# EAGLE design UART matrix v0.2 (EAGLE 7.4.0)
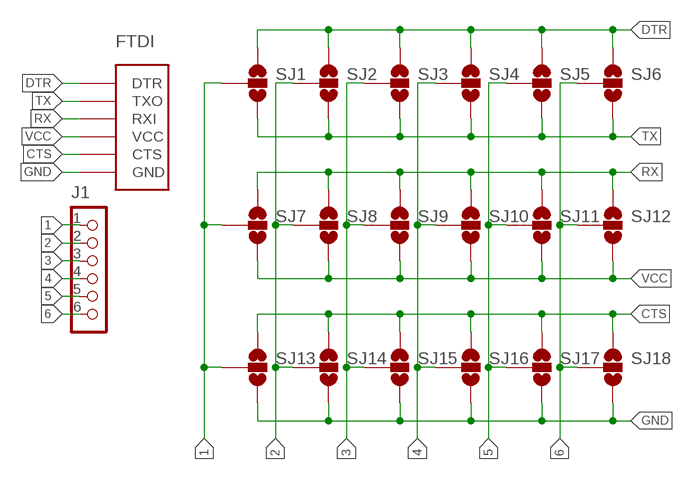
[diagram p0: schematic, sheet 1]

## Parts
FTDI  FTDI_DEVICE  [FTDI_DEVICE_SIDE]
J1  CON_HEADER_1X06-PTH  [M1X6]
SJ1  SOLDERJUMPER_2WAYT  [SJ_2]
SJ2  SOLDERJUMPER_2WAYT  [SJ_2]
SJ3  SOLDERJUMPER_2WAYT  [SJ_2]
SJ4  SOLDERJUMPER_2WAYT  [SJ_2]
SJ5  SOLDERJUMPER_2WAYT  [SJ_2]
SJ6  SOLDERJUMPER_2WAYT  [SJ_2]
SJ7  SOLDERJUMPER_2WAYT  [SJ_2]
SJ8  SOLDERJUMPER_2WAYT  [SJ_2]
SJ9  SOLDERJUMPER_2WAYT  [SJ_2]
SJ10  SOLDERJUMPER_2WAYT  [SJ_2]
SJ11  SOLDERJUMPER_2WAYT  [SJ_2]
SJ12  SOLDERJUMPER_2WAYT  [SJ_2]
SJ13  SOLDERJUMPER_2WAYT  [SJ_2]
SJ14  SOLDERJUMPER_2WAYT  [SJ_2]
SJ15  SOLDERJUMPER_2WAYT  [SJ_2]
SJ16  SOLDERJUMPER_2WAYT  [SJ_2]
SJ17  SOLDERJUMPER_2WAYT  [SJ_2]
SJ18  SOLDERJUMPER_2WAYT  [SJ_2]

## Nets
1: J1.1 SJ1.2 SJ7.2 SJ13.2
2: J1.2 SJ2.2 SJ8.2 SJ14.2
3: J1.3 SJ3.2 SJ9.2 SJ15.2
4: J1.4 SJ4.2 SJ10.2 SJ16.2
5: J1.5 SJ5.2 SJ11.2 SJ17.2
6: J1.6 SJ6.2 SJ12.2 SJ18.2
CTS: FTDI.P$5(CTS) SJ13.1 SJ14.1 SJ15.1 SJ16.1 SJ17.1 SJ18.1
DTR: FTDI.P$1(DTR) SJ1.1 SJ2.1 SJ3.1 SJ4.1 SJ5.1 SJ6.1
GND: FTDI.P$6(GND) SJ13.3 SJ14.3 SJ15.3 SJ16.3 SJ17.3 SJ18.3
RX: FTDI.P$3(RXI) SJ7.1 SJ8.1 SJ9.1 SJ10.1 SJ11.1 SJ12.1
TX: FTDI.P$2(TXO) SJ1.3 SJ2.3 SJ3.3 SJ4.3 SJ5.3 SJ6.3
VCC: FTDI.P$4(VCC) SJ7.3 SJ8.3 SJ9.3 SJ10.3 SJ11.3 SJ12.3

## Library data of the parts
FTDI = SparkFun-Connectors:FTDI_DEVICE: Connector which mates to FTDI basic or FTDI cable.
J1 = dp_devices:CON_HEADER_1X06
SJ1-SJ18 = SparkFun-Retired:SOLDERJUMPER_2WAY: Solder Jumper 2 way solder jumper

## Board
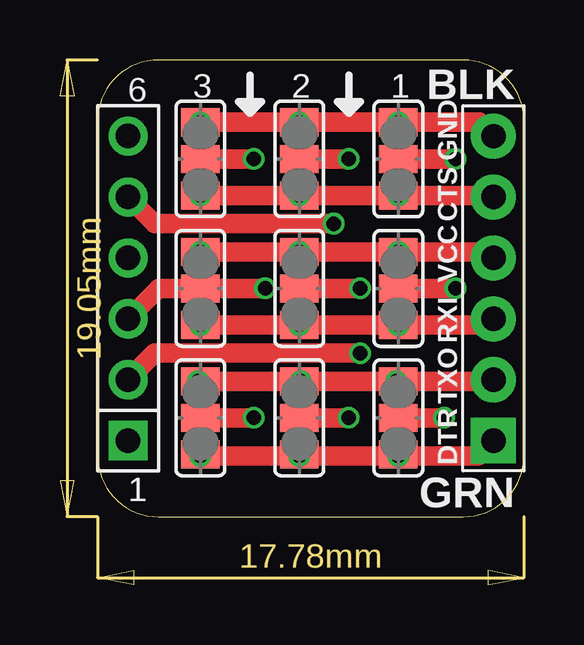
[diagram p1: board, top side]
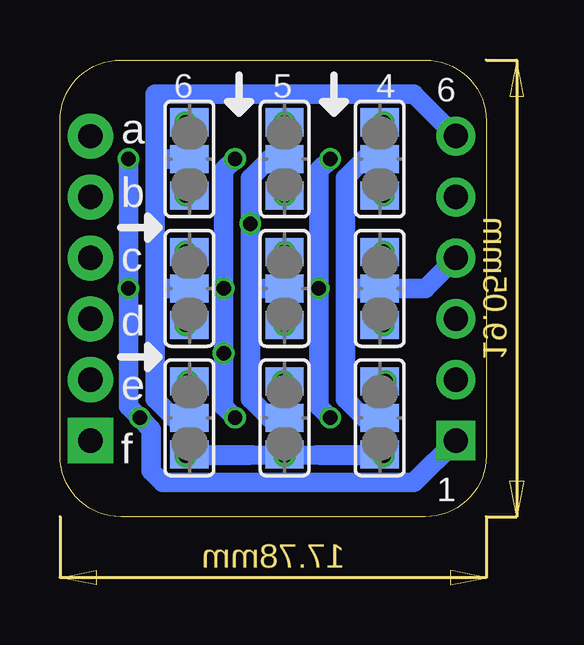
[diagram p2: board, bottom side, seen from below]

Size 17.78 x 19.05 mm. Coordinates in mm from the lower left corner, seen from the top.
Outline: 15.24,19.05 2.54,19.05 arc90 0,16.51 0,2.54 arc90 2.54,0 15.24,0 arc90 17.78,2.54 17.78,16.51 arc90 15.24,19.05
Copper layers (1*16): Top 0.035mm / dielectric 1.5mm / Bottom 0.035mm
Design rules "dirt_cheap_dirty_boards.v1": minimum track width 5mil, minimum drill 12mil, track to track 5mil, track to pad 5mil, pad to pad 5mil, via to via 5mil, smd to smd 0mil, copper to edge 10mil, drill to drill 10mil, minimum pad ring 10mil, minimum via ring 6mil, stop-mask expansion 2mil, vias tented up to drill 25mil, thermal gap 10mil

### Footprints (pad centres in the part's own frame; a part is rotated, then mirrored left to right if it is on the bottom)
FTDI_DEVICE_SIDE = drill 1.016 pad 1.88 square: P$1 -6.35,0 | drill 1.016 pad 1.88: P$2 -3.81,0; P$3 -1.27,0; P$4 1.27,0; P$5 3.81,0; P$6 6.35,0
M1X6 = drill 1.02 pad 1.632 square: 1 0,0 | drill 1.02 pad 1.632: 2 2.54,0; 3 5.08,0; 4 7.62,0; 5 10.16,0; 6 12.7,0
SJ_2 = smd 1.168 x 1.6: 1 -1.524,0; 2 0,0; 3 1.524,0

### Placement (x,y rotation side)
FTDI  16.51,9.53 90 top
J1  1.27,3.17 90 top
SJ1  12.54,4.13 90 top
SJ2  8.41,4.13 90 top
SJ3  4.29,4.13 90 top
SJ4  4.45,4.13 90 bottom
SJ5  8.41,4.13 90 bottom
SJ6  12.38,4.13 90 bottom
SJ7  12.54,9.53 90 top
SJ8  8.41,9.53 90 top
SJ9  4.29,9.53 90 top
SJ10  4.45,9.53 90 bottom
SJ11  8.41,9.53 90 bottom
SJ12  12.38,9.53 90 bottom
SJ13  12.54,14.92 90 top
SJ14  8.41,14.92 90 top
SJ15  4.29,14.92 90 top
SJ16  4.45,14.92 90 bottom
SJ17  8.41,14.92 90 bottom
SJ18  12.38,14.92 90 bottom

### Tracks (layer width: path | path; a pad name or v marks a point on that pad's centre or on a via)
1  (via drill 0.6)
  Top 0.813: SJ1.2 v14.45,4.13 | SJ7.2 v14.92,9.53 | SJ13.2 v14.92,14.92
  Bottom 0.813: v14.92,14.92 v14.92,9.53 14.92,4.6 v14.45,4.13 13.97,3.65 13.97,1.91 13.49,1.43 3.02,1.43 J1.1
2  (via drill 0.6)
  Top 0.813: SJ2.2 v10.48,4.13 | SJ8.2 v10.95,9.53 | SJ14.2 v10.48,14.92 | J1.2 2.38,6.83 v10.95,6.83
  Bottom 0.813: v10.48,14.92 10.95,14.45 v10.95,9.53 v10.95,6.83 10.95,4.6 v10.48,4.13
3  (via drill 0.6)
  Top 0.813: SJ3.2 v6.51,4.13 | v6.99,9.53 SJ9.2 2.54,9.53 J1.3 | SJ15.2 v6.51,14.92
  Bottom 0.813: v6.51,14.92 6.99,14.45 v6.99,9.53 6.99,4.6 v6.51,4.13
4
  Bottom 0.813: 5.87,9.53 5.87,4.92 5.08,4.13 SJ4.2 | 5.87,9.53 SJ10.2 2.54,9.53 J1.4 | 5.87,9.53 5.87,14.13 5.08,14.92 SJ16.2
5  (via drill 0.6)
  Top 0.813: J1.5 2.38,12.22 v9.84,12.22
  Bottom 0.813: 9.84,9.53 9.84,4.92 9.05,4.13 SJ5.2 | 9.84,9.53 v9.84,12.22 9.84,14.13 9.05,14.92 SJ17.2 | SJ11.2 9.84,9.53
6
  Bottom 0.813: 13.81,9.53 13.81,4.92 13.02,4.13 SJ6.2 | 13.81,9.53 13.81,14.92 | SJ12.2 13.81,9.53 | J1.6 3.02,17.62 13.81,17.62 13.81,14.92 | 13.81,14.92 SJ18.2
CTS  (via drill 0.6)  (2 unrouted)
  Top 0.813: SJ13.1 SJ17.1 SJ15.1 16.45,13.4 FTDI.P$5
  other vias: 12.54,13.4 8.41,13.4 4.29,13.4
DTR  (via drill 0.6)
  Top 0.813: SJ3.1 v4.29,2.54 | v4.29,2.54 v8.41,2.54 | SJ1.1 v12.54,2.54 v8.41,2.54 | SJ5.1 v8.41,2.54 | FTDI.P$1 15.88,2.54 v4.29,2.54
  Bottom 0.813: v8.41,2.54 SJ5.1 | SJ4.1 v12.54,2.54 | SJ6.1 v4.29,2.54
GND  (via drill 0.6)  (2 unrouted)
  Top 0.813: SJ13.3 SJ17.3 SJ15.3 15.94,16.45 FTDI.P$6
  other vias: 12.54,16.45 8.41,16.45 4.29,16.45
RX  (via drill 0.6)  (2 unrouted)
  Top 0.813: SJ7.1 SJ11.1 SJ9.1 16.26,8 FTDI.P$3
  other vias: 12.54,8 8.41,8 4.29,8
TX  (via drill 0.6)  (2 unrouted)
  Top 0.813: v12.45,5.65 SJ1.3 SJ5.3 v8.48,5.65 v4.19,5.65 SJ3.3 16.45,5.65 FTDI.P$2
  Bottom 0.813: v8.48,5.65 SJ5.3
VCC  (via drill 0.6)  (2 unrouted)
  Top 0.813: FTDI.P$4 16.26,11.05 SJ9.3 SJ11.3 SJ7.3
  other vias: 12.54,11.05 8.41,11.05 4.29,11.05

### Text on the board
tNames: 6 | 3 | 2 | 1 | 1
bNames: 6 | 4 | 5 | 6 | a / b / c / d / e / f | 1